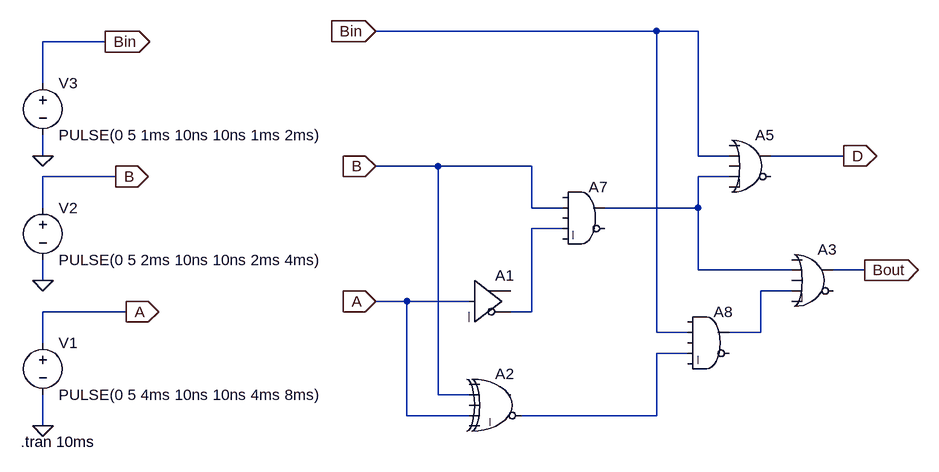
[diagram p0: schematic FullSubstractor.asc]
FullSubstractor.asc, the LTspice schematic file:
Version 4
SHEET 1 1208 680
WIRE 704 -112 272 -112
WIRE 768 -112 704 -112
WIRE -144 -96 -240 -96
WIRE -240 -32 -240 -96
WIRE -240 80 -240 48
WIRE 768 80 768 -112
WIRE 816 80 768 80
WIRE 992 80 880 80
WIRE 368 96 272 96
WIRE 512 96 368 96
WIRE -128 112 -240 112
WIRE 816 112 768 112
WIRE -240 160 -240 112
WIRE 512 160 512 96
WIRE 560 160 512 160
WIRE 768 160 768 112
WIRE 768 160 624 160
WIRE 560 192 512 192
WIRE 768 256 768 160
WIRE 912 256 768 256
WIRE 1024 256 976 256
WIRE -240 272 -240 240
WIRE 912 288 864 288
WIRE 320 304 272 304
WIRE 416 304 320 304
WIRE -112 320 -240 320
WIRE 512 320 512 192
WIRE 512 320 480 320
WIRE 704 352 704 -112
WIRE 752 352 704 352
WIRE 864 352 864 288
WIRE 864 352 816 352
WIRE -240 368 -240 320
WIRE 752 384 704 384
WIRE 368 448 368 96
WIRE 416 448 368 448
WIRE 320 480 320 304
WIRE 416 480 320 480
WIRE 704 480 704 384
WIRE 704 480 496 480
WIRE -240 496 -240 448
FLAG -128 112 B
IOPIN -128 112 Out
FLAG -112 320 A
IOPIN -112 320 Out
FLAG -144 -96 Bin
IOPIN -144 -96 Out
FLAG 272 304 A
IOPIN 272 304 In
FLAG 272 96 B
IOPIN 272 96 In
FLAG 272 -112 Bin
IOPIN 272 -112 In
FLAG 992 80 D
IOPIN 992 80 Out
FLAG 1024 256 Bout
IOPIN 1024 256 Out
FLAG -240 80 0
FLAG -240 272 0
FLAG -240 496 0
SYMBOL voltage -240 352 R0
WINDOW 123 0 0 Left 0
WINDOW 39 0 0 Left 0
SYMATTR InstName V1
SYMATTR Value PULSE(0 5 4ms 10ns 10ns 4ms 8ms)
SYMBOL voltage -240 144 R0
WINDOW 123 0 0 Left 0
WINDOW 39 0 0 Left 0
SYMATTR InstName V2
SYMATTR Value PULSE(0 5 2ms 10ns 10ns 2ms 4ms)
SYMBOL voltage -240 -48 R0
WINDOW 123 0 0 Left 0
WINDOW 39 0 0 Left 0
SYMATTR InstName V3
SYMATTR Value PULSE(0 5 1ms 10ns 10ns 1ms 2ms)
SYMBOL Digital\\buf 416 240 R0
SYMATTR InstName A1
SYMBOL Digital\\xor 464 400 R0
SYMATTR InstName A2
SYMBOL Digital\\and 592 112 R0
SYMATTR InstName A7
SYMBOL Digital\\and 784 304 R0
SYMATTR InstName A8
SYMBOL Digital\\or 848 32 R0
SYMATTR InstName A5
SYMBOL Digital\\or 944 208 R0
SYMATTR InstName A3
TEXT -274 520 Left 2 !.tran 10ms

The netlist it stands for:
* FullSubstractor.asc
V1 A 0 PULSE(0 5 4ms 10ns 10ns 4ms 8ms)
V2 B 0 PULSE(0 5 2ms 10ns 10ns 2ms 4ms)
V3 Bin 0 PULSE(0 5 1ms 10ns 10ns 1ms 2ms)
A1 A 0 0 0 0 N002 0 0 BUF
A2 0 B 0 A 0 N004 0 0 XOR
A7 0 B 0 N002 0 0 N001 0 AND
A8 0 Bin 0 N004 0 0 N003 0 AND
A5 0 Bin 0 N001 0 0 D 0 OR
A3 0 N001 0 N003 0 0 Bout 0 OR
.tran 10ms
.backanno
.end

* Results of the author's LTspice run, read from the files saved beside the schematic
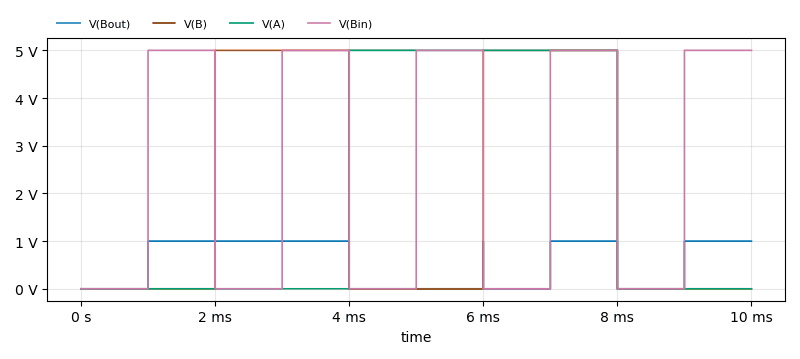
[diagram p1: Transient Analysis of FullSubstractor.asc, plotted from the saved traces]
* Transient Analysis, 1 run:
*   V(Bout): min 0 V, max 1 V, average 500 mV, rms 707.1 mV, last 1 V
*   V(B): min 0 V, max 5 V, average 2 V, rms 3.162 V, last 0 V
*   V(A): min 0 V, max 5 V, average 2 V, rms 3.162 V, last 0 V
*   V(Bin): min 0 V, max 5 V, average 2.5 V, rms 3.536 V, last 5 V